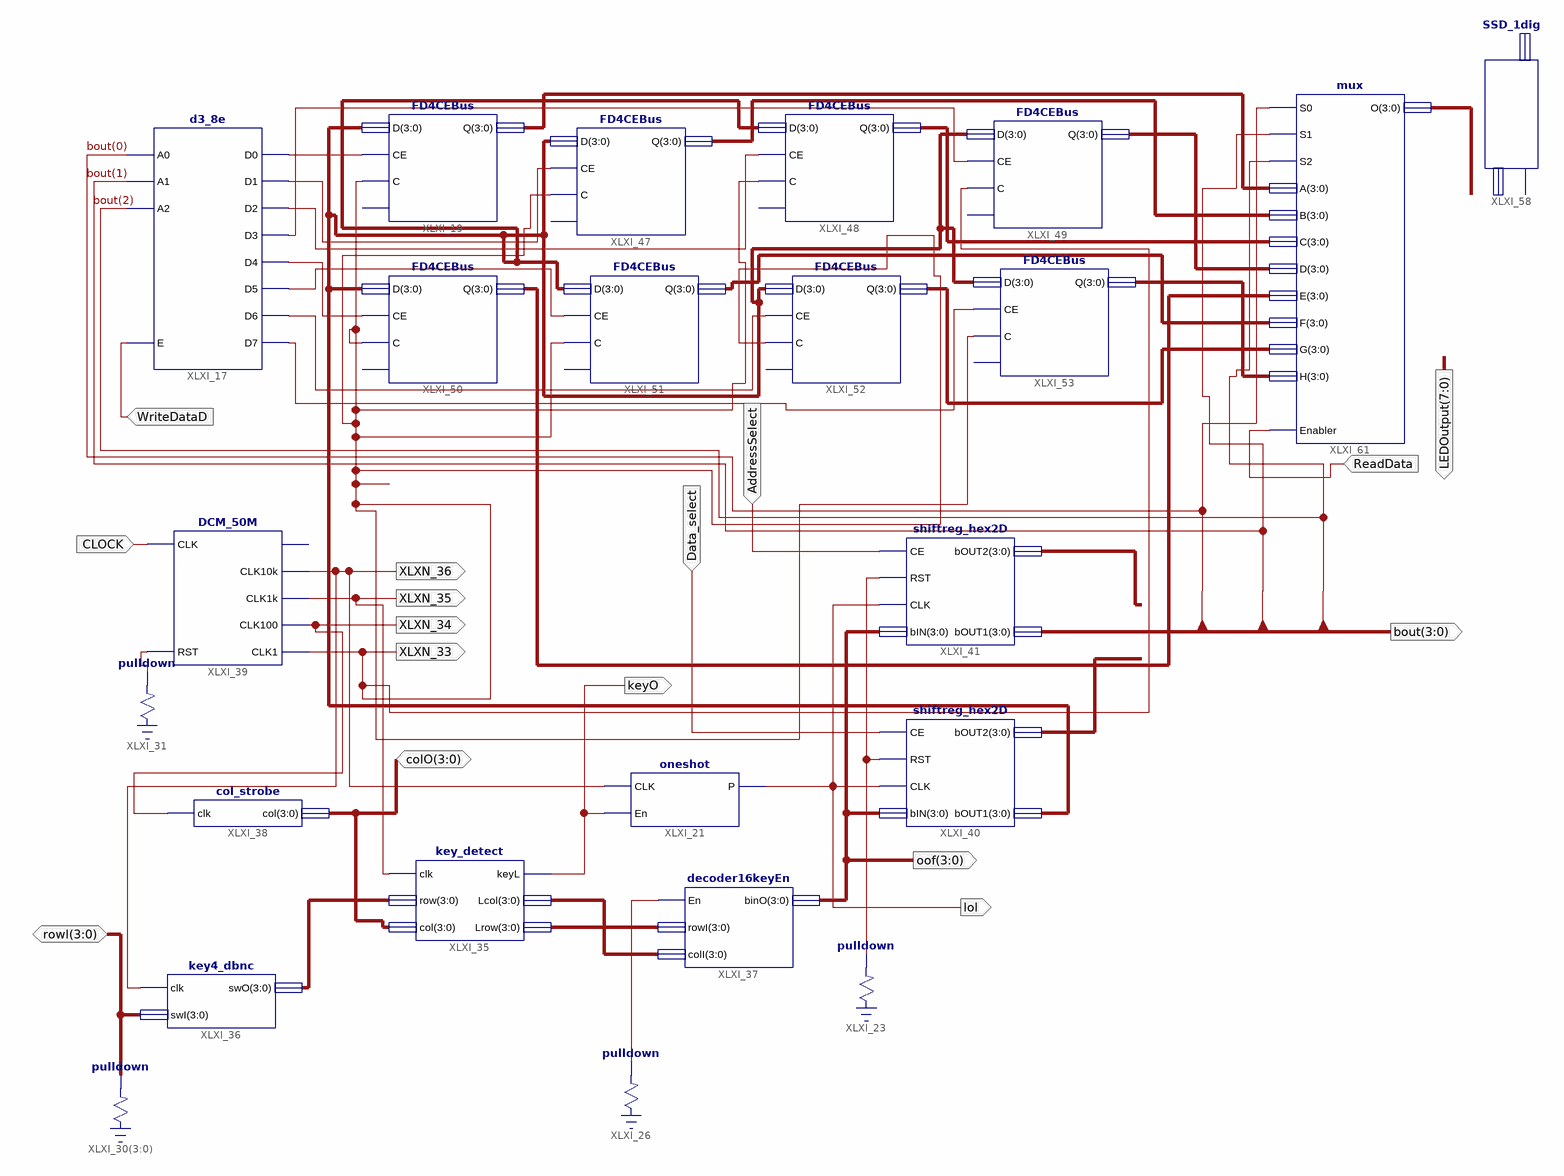
[diagram p0: schematic sheet 1]
// Xilinx ISE schematic keypad.sch (spartan3e) as structural Verilog: 23 symbols, 16 ports
module keypad (
  input  CLOCK,
  input  Data_select,
  input  AddressSelect,
  input  WriteDataD,
  input  ReadData,
  inout  [3:0] colO,
  inout  [3:0] rowl,
  output [3:0] bout,
  output [3:0] oof,
  output lol,
  output keyO,
  output XLXN_33,
  output XLXN_34,
  output XLXN_35,
  output XLXN_36,
  output [7:0] LEDOutput
);

  wire XLXN_19, XLXN_27, XLXN_39, XLXN_85, XLXN_86, XLXN_87, XLXN_88, XLXN_89, XLXN_90, XLXN_91, XLXN_92;
  wire [3:0] XLXN_9, XLXN_11, XLXN_25, XLXN_26, XLXN_29, XLXN_93, XLXN_158, XLXN_169, XLXN_170, XLXN_171,
       XLXN_172, XLXN_173, XLXN_174, XLXN_175, XLXN_176;

  oneshot XLXI_21 (.CLK(XLXN_36), .En(keyO), .P(lol));
  \pulldown  XLXI_23 (.O(XLXN_19));
  \pulldown  XLXI_26 (.O(XLXN_27));
  \pulldown  XLXI_30[3:0] (.O(rowl));
  \pulldown  XLXI_31 (.O(XLXN_39));
  key_detect XLXI_35 (.clk(XLXN_35), .row(XLXN_29), .col(colO), .keyL(keyO), .Lcol(XLXN_25), .Lrow(XLXN_26));
  key4_dbnc XLXI_36 (.clk(XLXN_36), .swI(rowl), .swO(XLXN_29));
  decoder16keyEn XLXI_37 (.En(XLXN_27), .rowI(XLXN_26), .colI(XLXN_25), .binO(oof));
  col_strobe XLXI_38 (.clk(XLXN_34), .col(colO));
  DCM_50M XLXI_39 (
    .CLK(CLOCK), .RST(XLXN_39), .CLK10k(XLXN_36), .CLK1k(XLXN_35), .CLK100(XLXN_34), .CLK1(XLXN_33));  // open: CLK1M
  shiftreg_hex2D XLXI_40 (.CE(Data_select), .RST(XLXN_19), .CLK(lol), .bIN(oof), .bOUT2(XLXN_11), .bOUT1(XLXN_93));
  shiftreg_hex2D XLXI_41 (.CE(AddressSelect), .RST(XLXN_19), .CLK(lol), .bIN(oof), .bOUT2(XLXN_9), .bOUT1(bout));
  d3_8e XLXI_17 (
    .A0(bout[0]), .A1(bout[1]), .A2(bout[2]), .E(WriteDataD), .D0(XLXN_85), .D1(XLXN_86), .D2(XLXN_87),
    .D3(XLXN_88), .D4(XLXN_89), .D5(XLXN_90), .D6(XLXN_91), .D7(XLXN_92));
  FD4CEBus XLXI_19 (.D(XLXN_93), .CE(XLXN_85), .C(XLXN_33), .Q(XLXN_169));  // open: CLR
  FD4CEBus XLXI_47 (.D(XLXN_93), .CE(XLXN_86), .C(XLXN_33), .Q(XLXN_170));  // open: CLR
  FD4CEBus XLXI_48 (.D(XLXN_93), .CE(XLXN_87), .C(XLXN_33), .Q(XLXN_171));  // open: CLR
  FD4CEBus XLXI_49 (.D(XLXN_93), .CE(XLXN_88), .C(XLXN_33), .Q(XLXN_172));  // open: CLR
  FD4CEBus XLXI_50 (.D(XLXN_93), .CE(XLXN_89), .C(XLXN_33), .Q(XLXN_173));  // open: CLR
  FD4CEBus XLXI_51 (.D(XLXN_93), .CE(XLXN_90), .C(XLXN_33), .Q(XLXN_174));  // open: CLR
  FD4CEBus XLXI_52 (.D(XLXN_93), .CE(XLXN_91), .C(XLXN_33), .Q(XLXN_175));  // open: CLR
  FD4CEBus XLXI_53 (.D(XLXN_93), .CE(XLXN_92), .C(XLXN_33), .Q(XLXN_176));  // open: CLR
  SSD_1dig XLXI_58 (.hexD(XLXN_158), .sseg(LEDOutput));  // open: dp_in
  mux XLXI_61 (
    .S0(bout[0]), .S1(bout[1]), .S2(bout[2]), .A(XLXN_169), .B(XLXN_170), .C(XLXN_171), .D(XLXN_172),
    .E(XLXN_173), .F(XLXN_174), .G(XLXN_175), .H(XLXN_176), .Enabler(ReadData), .O(XLXN_158));
endmodule
